# Altium schematic sheet Sheet2.SchDoc
size 420 x 297 mm; Address1: Address1; Address2: Address2; Address3: Address3; Address4: Address4; DocumentNumber: КПБТ.468739.004 Э3; SheetNumber: 1; Scale: 1:1; DocumentType: Схема электрическая принципиальная; FirstReferrence: АБВГ.123456.001
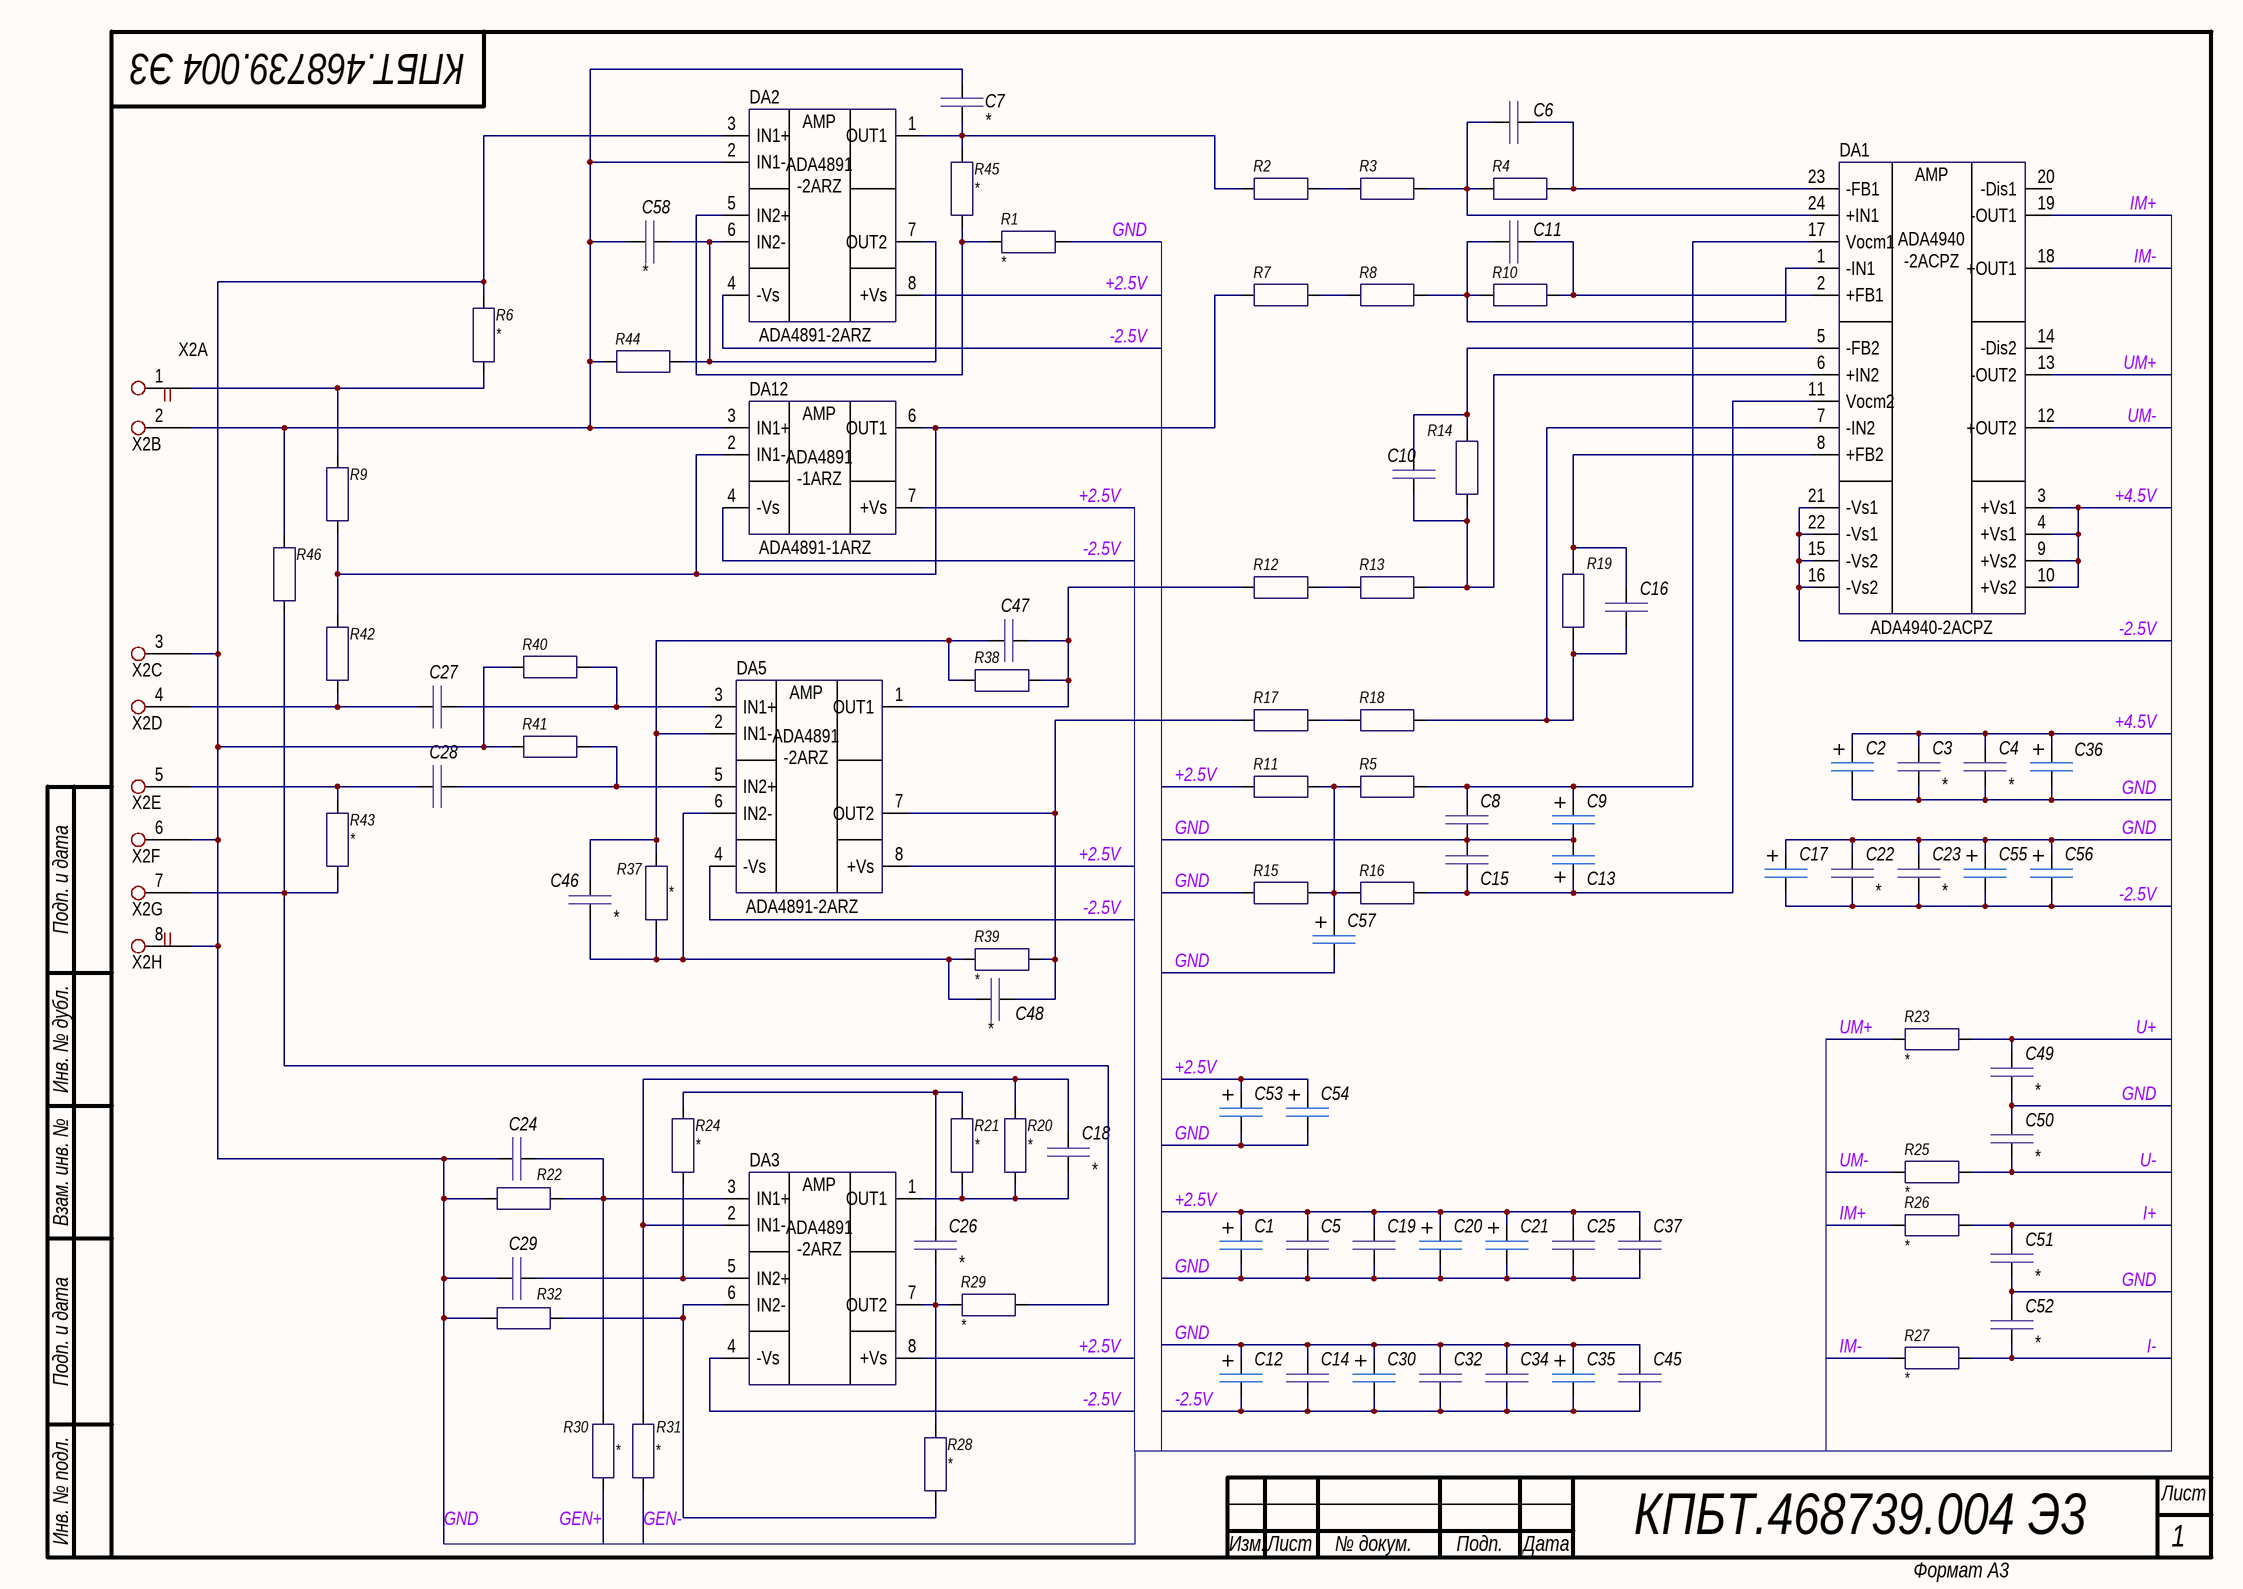
[diagram p0: Sheet2.SchDoc]

## Parts
C1  (no value)  [CAPT: tepy B]
C2  (no value)  [CAPT: tepy B]
C3  *  [CAP:0805]
C4  *  [CAP:0805]
C5  *  [CAP:0805]  (value not drawn)
C6  *  [CAP:0805]  (value not drawn)
C7  *  [CAP:0805]
C8  *  [CAP:0805]  (value not drawn)
C9  (no value)  [CAPT: tepy B]
C10  *  [CAP:0805]  (value not drawn)
C11  *  [CAP:0805]  (value not drawn)
C12  (no value)  [CAPT: tepy B]
C13  (no value)  [CAPT: tepy B]
C14  *  [CAP:0805]  (value not drawn)
C15  *  [CAP:0805]  (value not drawn)
C16  *  [CAP:0805]  (value not drawn)
C17  (no value)  [CAPT: tepy B]
C18  *  [CAP:0805]
C19  *  [CAP:0805]  (value not drawn)
C20  (no value)  [CAPT: tepy B]
C21  (no value)  [CAPT: tepy B]
C22  *  [CAP:0805]
C23  *  [CAP:0805]
C24  *  [CAP:0805]  (value not drawn)
C25  *  [CAP:0805]  (value not drawn)
C26  *  [CAP:0805]
C27  *  [CAP:0805]  (value not drawn)
C28  *  [CAP:0805]  (value not drawn)
C29  *  [CAP:0805]  (value not drawn)
C30  (no value)  [CAPT: tepy B]
C32  *  [CAP:0805]  (value not drawn)
C34  *  [CAP:0805]  (value not drawn)
C35  (no value)  [CAPT: tepy B]
C36  (no value)  [CAPT: tepy B]
C37  *  [CAP:0805]  (value not drawn)
C45  *  [CAP:0805]  (value not drawn)
C46  *  [CAP:0805]
C47  *  [CAP:0805]  (value not drawn)
C48  *  [CAP:0805]
C49  *  [CAP:0805]
C50  *  [CAP:0805]
C51  *  [CAP:0805]
C52  *  [CAP:0805]
C53  (no value)  [CAPT: tepy B]
C54  (no value)  [CAPT: tepy B]
C55  (no value)  [CAPT: tepy B]
C56  (no value)  [CAPT: tepy B]
C57  (no value)  [CAPT: tepy B]
C58  *  [CAP:0805]
DA1  ADA4940-2ACPZ  [LFCSP-24]
DA2  ADA4891-2ARZ  [SOIC-8]
DA3  ADA4891-2ARZ  [SOIC-8]  (value not drawn)
DA5  ADA4891-2ARZ  [SOIC-8]
DA12  ADA4891-1ARZ  [SOIC-8]
R1  *  [RES:0805]
R2  *  [RES:0805]  (value not drawn)
R3  *  [RES:0805]  (value not drawn)
R4  *  [RES:0805]  (value not drawn)
R5  *  [RES:0805]  (value not drawn)
R6  *  [RES:0805]
R7  *  [RES:0805]  (value not drawn)
R8  *  [RES:0805]  (value not drawn)
R9  *  [RES:0805]  (value not drawn)
R10  *  [RES:0805]  (value not drawn)
R11  *  [RES:0805]  (value not drawn)
R12  *  [RES:0805]  (value not drawn)
R13  *  [RES:0805]  (value not drawn)
R14  *  [RES:0805]  (value not drawn)
R15  *  [RES:0805]  (value not drawn)
R16  *  [RES:0805]  (value not drawn)
R17  *  [RES:0805]  (value not drawn)
R18  *  [RES:0805]  (value not drawn)
R19  *  [RES:0805]  (value not drawn)
R20  *  [RES:0805]
R21  *  [RES:0805]
R22  *  [RES:0805]  (value not drawn)
R23  *  [RES:0805]
R24  *  [RES:0805]
R25  *  [RES:0805]
R26  *  [RES:0805]
R27  *  [RES:0805]
R28  *  [RES:0805]
R29  *  [RES:0805]
R30  *  [RES:0805]
R31  *  [RES:0805]
R32  *  [RES:0805]  (value not drawn)
R37  *  [RES:0805]
R38  *  [RES:0805]  (value not drawn)
R39  *  [RES:0805]
R40  *  [RES:0805]  (value not drawn)
R41  *  [RES:0805]  (value not drawn)
R42  *  [RES:0805]  (value not drawn)
R43  *  [RES:0805]
R44  *  [RES:0805]  (value not drawn)
R45  *  [RES:0805]
R46  (no value)  [RES:0805]
X2  (no value)  [15EDGVC-3.5-08P-14-00AH]  (parts A,B,C,D,E,F,G,H of 8)

## Nets
+2.5V: C1.2 C5.2 C19.2 C20.2 C21.2 C25.2 C37.2 C53.2 C54.2 DA2.8(+Vs) DA3.8(+Vs) DA5.8(+Vs) DA12.7(+Vs) R11.2
+4.5V: C2.2 C3.2 C4.2 C36.2 DA1.3(+Vs1) DA1.4(+Vs1) DA1.9(+Vs2) DA1.10(+Vs2)
-2.5V: C12.1 C14.1 C17.1 C22.1 C23.1 C30.1 C32.1 C34.1 C35.1 C45.1 C55.1 C56.1 DA1.15(-Vs2) DA1.16(-Vs2) DA1.21(-Vs1) DA1.22(-Vs1) DA2.4(-Vs) DA3.4(-Vs) DA5.4(-Vs) DA12.4(-Vs)
GEN+: R30.1
GEN-: R31.1
GND: C1.1 C2.1 C3.1 C4.1 C5.1 C8.1 C9.1 C12.2 C13.1 C14.2 C15.2 C17.2 C19.1 C20.1 C21.1 C22.2 C23.2 C24.2 C25.1 C29.2 C30.2 C32.2 C34.2 C35.2 C36.1 C37.1 C45.2 C49.1 C50.2 C51.1 C52.2 C53.1 C54.1 C55.2 C56.2 C57.1 DA2.3(IN1+) R1.1 R6.2 R15.2 R22.2 R32.2 R40.2 R41.2 X2.3 X2.6 X2.8
I+: C51.2 R26.1
I-: C52.1 R27.1
IM+: DA1.19(-OUT1) R26.2
IM-: DA1.18(+OUT1) R27.2
U+: C49.2 R23.1
U-: C50.1 R25.1
UM+: DA1.13(-OUT2) R23.2
UM-: DA1.12(+OUT2) R25.2
NetC6_1: C6.1 DA1.23(-FB1) R4.1
NetC6_2: C6.2 DA1.24(+IN1) R3.1 R4.2
NetC7_1: C7.1 DA2.1(OUT1) R2.2 R45.2
NetC7_2: C7.2 C58.2 DA2.2(IN1-) DA12.3(IN1+) R44.2 R46.2 X2.2
NetC8_2: C8.2 C9.2 DA1.17(Vocm1) R5.1
NetC10_1: C10.1 DA1.5(-FB2) R14.1
NetC10_2: C10.2 DA1.6(+IN2) R13.1 R14.2
NetC11_1: C11.1 DA1.2(+FB1) R10.1
NetC11_2: C11.2 DA1.1(-IN1) R8.1 R10.2
NetC13_2: C13.2 C15.1 DA1.11(Vocm2) R16.1
NetC16_1: C16.1 DA1.7(-IN2) R18.1 R19.2
NetC16_2: C16.2 DA1.8(+FB2) R19.1
NetC18_1: C18.1 DA3.1(OUT1) R20.1 R21.1
NetC18_2: C18.2 DA3.2(IN1-) R20.2 R31.2
NetC24_1: C24.1 DA3.3(IN1+) R22.1 R30.2
NetC26_1: C26.1 DA3.7(OUT2) R28.2 R29.1
NetC26_2: C26.2 R21.2 R24.2
NetC27_1: C27.1 DA5.3(IN1+) R40.1
NetC27_2: C27.2 R42.1 X2.4
NetC28_1: C28.1 DA5.5(IN2+) R41.1
NetC28_2: C28.2 R43.2 X2.5
NetC29_1: C29.1 DA3.5(IN2+) R24.1
NetC46_1: C46.1 C47.2 DA5.2(IN1-) R37.1 R38.2
NetC46_2: C46.2 C48.1 DA5.6(IN2-) R37.2 R39.1
NetC47_1: C47.1 DA5.1(OUT1) R12.2 R38.1
NetC48_2: C48.2 DA5.7(OUT2) R17.2 R39.2
NetC57_2: C57.2 R5.2 R11.1 R15.1 R16.2
NetC58_1: C58.1 DA2.6(IN2-) DA2.7(OUT2) R44.1
NetDA2_5: DA2.5(IN2+) R1.2 R45.1
NetDA3_6: DA3.6(IN2-) R28.1 R32.1
NetDA12_2: DA12.2(IN1-) DA12.6(OUT1) R7.2 R9.1 R42.2
NetR2_1: R2.1 R3.2
NetR6_1: R6.1 R9.2 X2.1
NetR7_1: R7.1 R8.2
NetR12_1: R12.1 R13.2
NetR17_1: R17.1 R18.2
NetR29_2: R29.2 R43.1 R46.1 X2.7

Not connected (* = marked no-connect by the designer): DA1 14(-Dis2) 20(-Dis1)

## Notes on the sheet
- Подп. и дата
- Инв. № дубл.
- Взам. инв. №
- Инв. № подл.
- Изм.
- Лист
- № докум.
- Подп.
- Дата
- Формат А3
- (in symbol ADA4891-1ARZ) AMP / ADA4891 / -1ARZ /
- (in symbol ADA4891-2ARZ) AMP / ADA4891 / -2ARZ /
- (in symbol ADA4940-2ACPZ) AMP / ADA4940 / -2ACPZ /

## Library data of the parts
C1 C2 C9 C12 C13 C17 C20 C21 C30 C35 C36 C53-C57 = CAPT: tepy B: Part Number: CAPT: tepy B
C3-C8 C10 C11 C14-C16 C18 C19 C22-C29 C32 C34 C37 C45-C52 C58 = Capacitor 0805: Case: *; HelpURL: *; Manufacature: *; Model: *; Value: *; Part Number: Capacitor 0805
R1-R32 R37-R46 = Resistor 0805: Total Power Dissipation: 0,125W; Model: *; Manufcacture: *; HelpURL: *; Case: *; Value: *; Part Number: Resistor 0805
X2 = 15EDGVC-3.5-08P-14-00AH_1: Model: *; Manufcacture: *; HelpURL: *; Case: *; Value: *; Part Number: 15EDGVC-3.5-08P-14-00AH_1
DA1 = ADA4940-2ACPZ: Model: *; Manufcacture: *; HelpURL: *; Case: *; Value: *; Part Number: ADA4940-2ACPZ
DA2 DA3 DA5 = ADA4891-2ARZ: Model: *; Manufcacture: *; HelpURL: *; Case: *; Value: *; Part Number: ADA4891-2ARZ
DA12 = ADA4891-1ARZ: Model: *; Manufcacture: *; HelpURL: *; Case: *; Value: *; Part Number: ADA4891-1ARZ